# Altium schematic sheet QCopterMV_EXPAND_Sch.SchDoc: QCopterMV-EXPAND
size 127 x 101 mm; Author: Hom; CompanyName: KitSprout; DrawnBy: Hom; Engineer: Hom; Organization: KitSprout; Revision: A; SheetNumber: 1; SheetTotal: 1; License: CC BY-SA 4.0; Version: 2.0; LibVersion: 2.7; PageSetup: Record=PageOptions|CenterHorizontal=True|CenterVertical=True|PrintScale=1.00|XCorrection=1.00|YCorrection=1.00|PrintKind=0|BorderSize=5000000|LeftOffset=0|BottomOffset=0|Orientation=2|PaperLength=1000|PaperWidth=1000|Scale=100|PaperSource=7|PrintQuality=-4|MediaType=1|DitherType=10|PaperKind=A4|PrintScaleMode=0
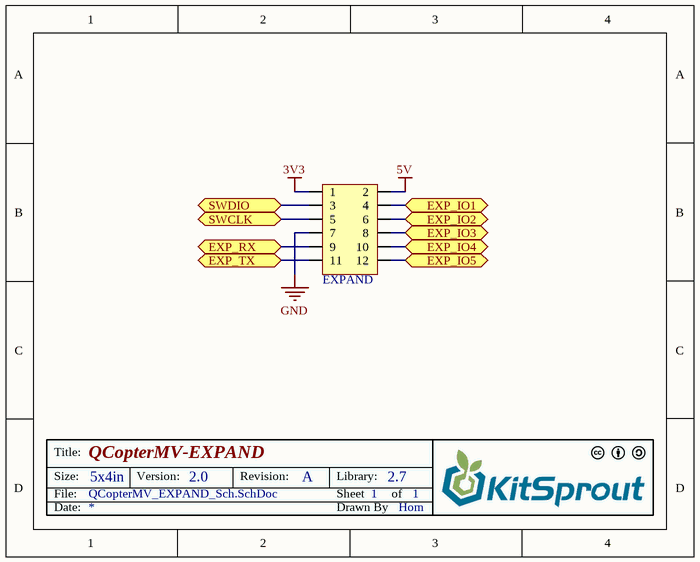
[diagram p0: QCopterMV_EXPAND_Sch.SchDoc]

## Parts
EXPAND  HDR2x6_1.27  [HDR2X6_1.27_180HF]  (value not drawn)

## Ports
EXP_IO1, EXP_IO2, EXP_IO3, EXP_IO4, EXP_IO5, EXP_RX, EXP_TX, SWCLK, SWDIO

## Nets
3V3: EXPAND.1
5V: EXPAND.2
GND: EXPAND.7
EXP_IO1: EXPAND.4 ; port EXP_IO1
EXP_IO2: EXPAND.6 ; port EXP_IO2
EXP_IO3: EXPAND.8 ; port EXP_IO3
EXP_IO4: EXPAND.10 ; port EXP_IO4
EXP_IO5: EXPAND.12 ; port EXP_IO5
EXP_RX: EXPAND.9 ; port EXP_RX
EXP_TX: EXPAND.11 ; port EXP_TX
SWCLK: EXPAND.5 ; port SWCLK
SWDIO: EXPAND.3 ; port SWDIO

## Notes on the sheet
- Title:
- Size:
- Date:
- File:
- 5x4in
- Version:
- Revision:
- Sheet
- Drawn By
- Library:
- of

## Library data of the parts
EXPAND = HDR2x6_1.27: Header